# Altium schematic sheet Sheet1.SchDoc
size A4
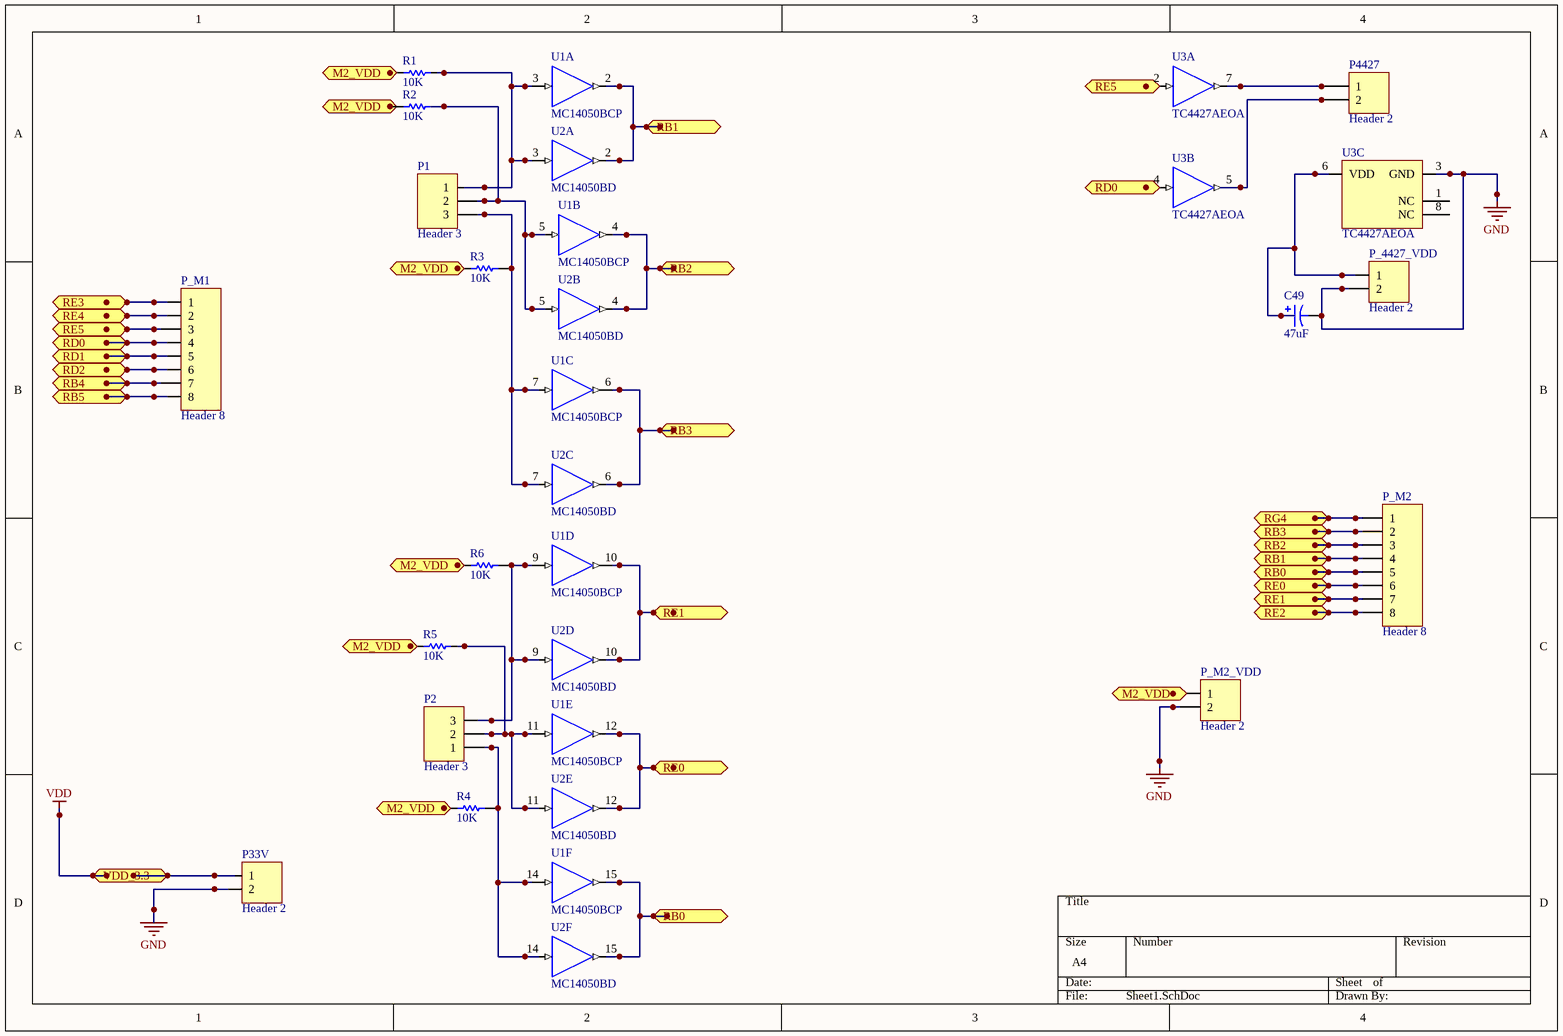
[diagram p0: Sheet1.SchDoc]

## Parts
C49  47uF  [NSOALUMB]
P1  Header 3  [BIG3]
P2  Header 3  [BIG3]
P33V  Header 2  [HDR1X2]
P4427  Header 2  [BIG2]
P_4427_VDD  Header 2  [BIG2]
P_M1  Header 8  [HDR1X8]
P_M2  Header 8  [HDR1X8]
P_M2_VDD  Header 2  [BIG2]
R1  10K  [RESC3216L]
R2  10K  [RESC3216L]
R3  10K  [RESC3216L]
R4  10K  [RESC3216L]
R5  10K  [RESC3216L]
R6  10K  [RESC3216L]
U1  MC14050BCP  [648-08]  (parts A,B,C,D,E,F of 6)
U2  MC14050BD  [751B-05_N]  (parts A,B,C,D,E,F of 6)
U3  TC4427AEOA  [SOIC-OA8_N]  (parts A,B,C of 3)

## Ports
M2_VDD, RB0, RB1, RB2, RB3, RB4, RB5, RD0, RD1, RD2, RE0, RE1, RE1 (bidir), RE2, RE3, RE4, RE5, RG4, VDD_3.3

## Nets
GND: C49.2 P33V.2 P_4427_VDD.2 P_M2_VDD.2 U1.8(GND) U2.8(GND) U3.3(GND)
VDD: P33V.1 U1.1(VDD) U2.1(VDD) ; port VDD_3.3
RB0: P_M2.5 U1.15(OUT) U2.15(OUT) ; port RB0
RB1: P_M2.4 U1.2(OUT) U2.2(OUT) ; port RB1
RB2: P_M2.3 U1.4(OUT) U2.4(OUT) ; port RB2
RB3: P_M2.2 U1.6(OUT) U2.6(OUT) ; port RB3
RB4: P_M1.7 ; port RB4
RB5: P_M1.8 ; port RB5
RD0: P_M1.4 ; port RD0
RD1: P_M1.5 ; port RD1
RD2: P_M1.6 ; port RD2
RE0: P_M2.6 U1.12(OUT) U2.12(OUT) ; port RE0
RE1: P_M2.7 U1.10(OUT) U2.10(OUT) ; port RE1
RE2: P_M2.8 ; port RE2
RE3: P_M1.1 ; port RE3
RE4: P_M1.2 ; port RE4
RE5: P_M1.3 ; port RE5
RG4: P_M2.1 ; port RG4
NetC49_1: C49.1 P_4427_VDD.1 U3.6(VDD)
NetP1_1: P1.1 R1.2 U1.3(IN) U2.3(IN)
NetP1_2: P1.2 R2.2 U1.5(IN) U2.5(IN)
NetP1_3: P1.3 R3.2 U1.7(IN) U2.7(IN)
NetP2_1: P2.1 R4.2 U1.14(IN) U2.14(IN)
NetP2_2: P2.2 R5.2 U1.11(IN) U2.11(IN)
NetP2_3: P2.3 R6.2 U1.9(IN) U2.9(IN)
NetP4427_1: P4427.1 U3.7(OUTA)
NetP4427_2: P4427.2 U3.5(OUTB)

Not connected (* = marked no-connect by the designer): P_M2_VDD 1; R1 1; R2 1; R3 1; R4 1; R5 1; R6 1; U3 1(NC) 2(INA) 4(INB) 8(NC)

## Library data of the parts
C49 = Cap Pol1: Polarized Capacitor (Radial); Published: 8-Jun-2000; LatestRevisionDate: 17-Jul-2002; LatestRevisionNote: Re-released for DXP Platform.; PackageReference: RB7.6-15; Publisher: Altium Limited; Value: 47uF
P1 P2 = Header 3: Header, 3-Pin; LatestRevisionDate: 17-Jul-2002; LatestRevisionNote: Re-released for DXP Platform.; Publisher: Altium Limited
P33V P4427 P_4427_VDD P_M2_VDD = Header 2: Header, 2-Pin; LatestRevisionDate: 17-Jul-2002; LatestRevisionNote: Re-released for DXP Platform.; Publisher: Altium Limited
P_M1 P_M2 = Header 8: Header, 8-Pin; LatestRevisionDate: 17-Jul-2002; LatestRevisionNote: Re-released for DXP Platform.; Publisher: Altium Limited
R1-R6 = Res Semi: Semiconductor Resistor; Published: 8-Jun-2000; LatestRevisionDate: 17-Jul-2002; LatestRevisionNote: Re-released for DXP Platform.; PackageReference: AXIAL-0.5; Publisher: Altium Limited; Value: 10K
U1 = MC14050BCP: Hex Non-Inverting Buffer; Note: NC Pins are 13,16; Published: 15-Apr-2002; DatasheetVersion: 1995; PackageVersion: Apr-2000; PackageReference: 648-08; Publisher: Altium Limited; PackageDescription: DIP; 16 Leads; Row Spacing 7.62 mm; Pitch 2.54 mm; Code_JEDEC: MS-001-BB; ComponentLink1Description: Manufacturer Link; ComponentLink1URL: http://www.onsemi.com/; ComponentLink2Description: Datasheet; ComponentLink2URL: http://www.onsemi.com/pub/Collateral/MC14049B-D.PDF
U2 = MC14050BD: Hex Non-Inverting Buffer; Note: NC Pins are 13,16; Published: 15-Apr-2002; LatestRevisionDate: 13-Apr-2006; LatestRevisionNote: IPC-7351 Footprint Added.; DatasheetVersion: 1995; PackageVersion: Oct-1999; PackageReference: 751B-05; Publisher: Altium Limited; PackageDescription: 16-Pin Small Outline Integrated Circuit 1.27 mm Pitch; Code_JEDEC: MS-012-AC; Code_IPC: SOIC127P600-16; ComponentLink1Description: Manufacturer Link; ComponentLink1URL: http://www.onsemi.com/; ComponentLink2Description: Datasheet; ComponentLink2URL: http://www.onsemi.com/pub/Collateral/MC14049B-D.PDF
U3 = TC4427AEOA: 1.5A Dual High-Speed Power MOSFET Driver, Non-Inverting, Industrial Temperature; FirstPublished: 29-Jan-2009; DatasheetVersion: revF, Jan-2006; PackageVersion: revBB, Aug-2009; PackageReference: SOIC-OA8; Publisher: Altium Limited; PackageDescription: 8-Lead Plastic Small Outline (OA) - Narrow, 3.90mm Body [SOIC]; Supplier 1: Digi-Key; Supplier Part Number 1: TC4427AEOA-ND; Supplier 2: Farnell; Supplier Part Number 2: 1292285; Supplier 3: Newark; Supplier Part Number 3: 96K4020; Code_IPC: SOIC127P600-8; ComponentLink1Description: Datasheet; ComponentLink1URL: http://ww1.microchip.com/downloads/en/DeviceDoc/21423F.pdf; ComponentLink2Description: Packaging Specification; ComponentLink2URL: http://www.microchip.com/stellent/groups/techpub_sg/documents/packagingspec/en012702.pdf; ComponentLink3Description: Microchip.com Home; ComponentLink3URL: http://www.microchip.com/